# EasyEDA Pro project ADA4530_2025-03-15.epro, board PCB7
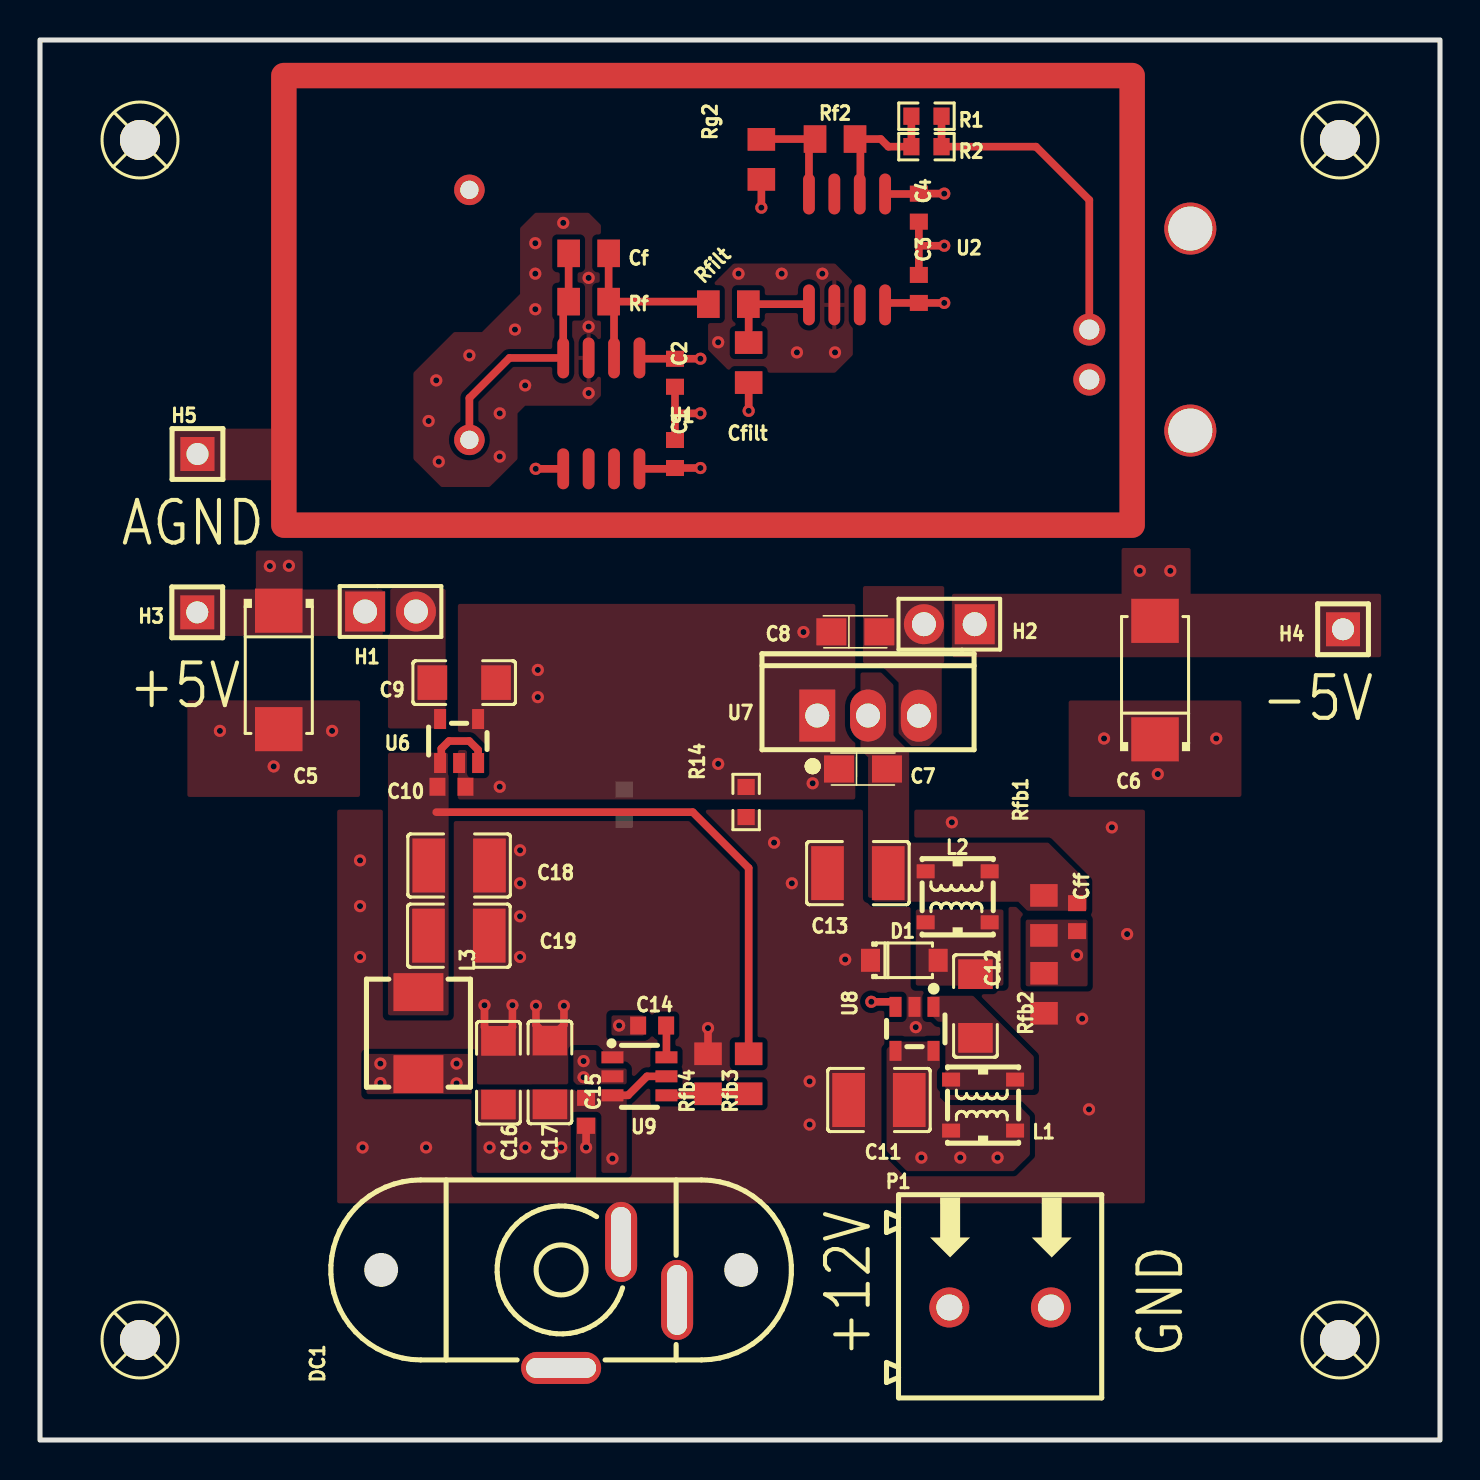
[diagram p12: board, top side]
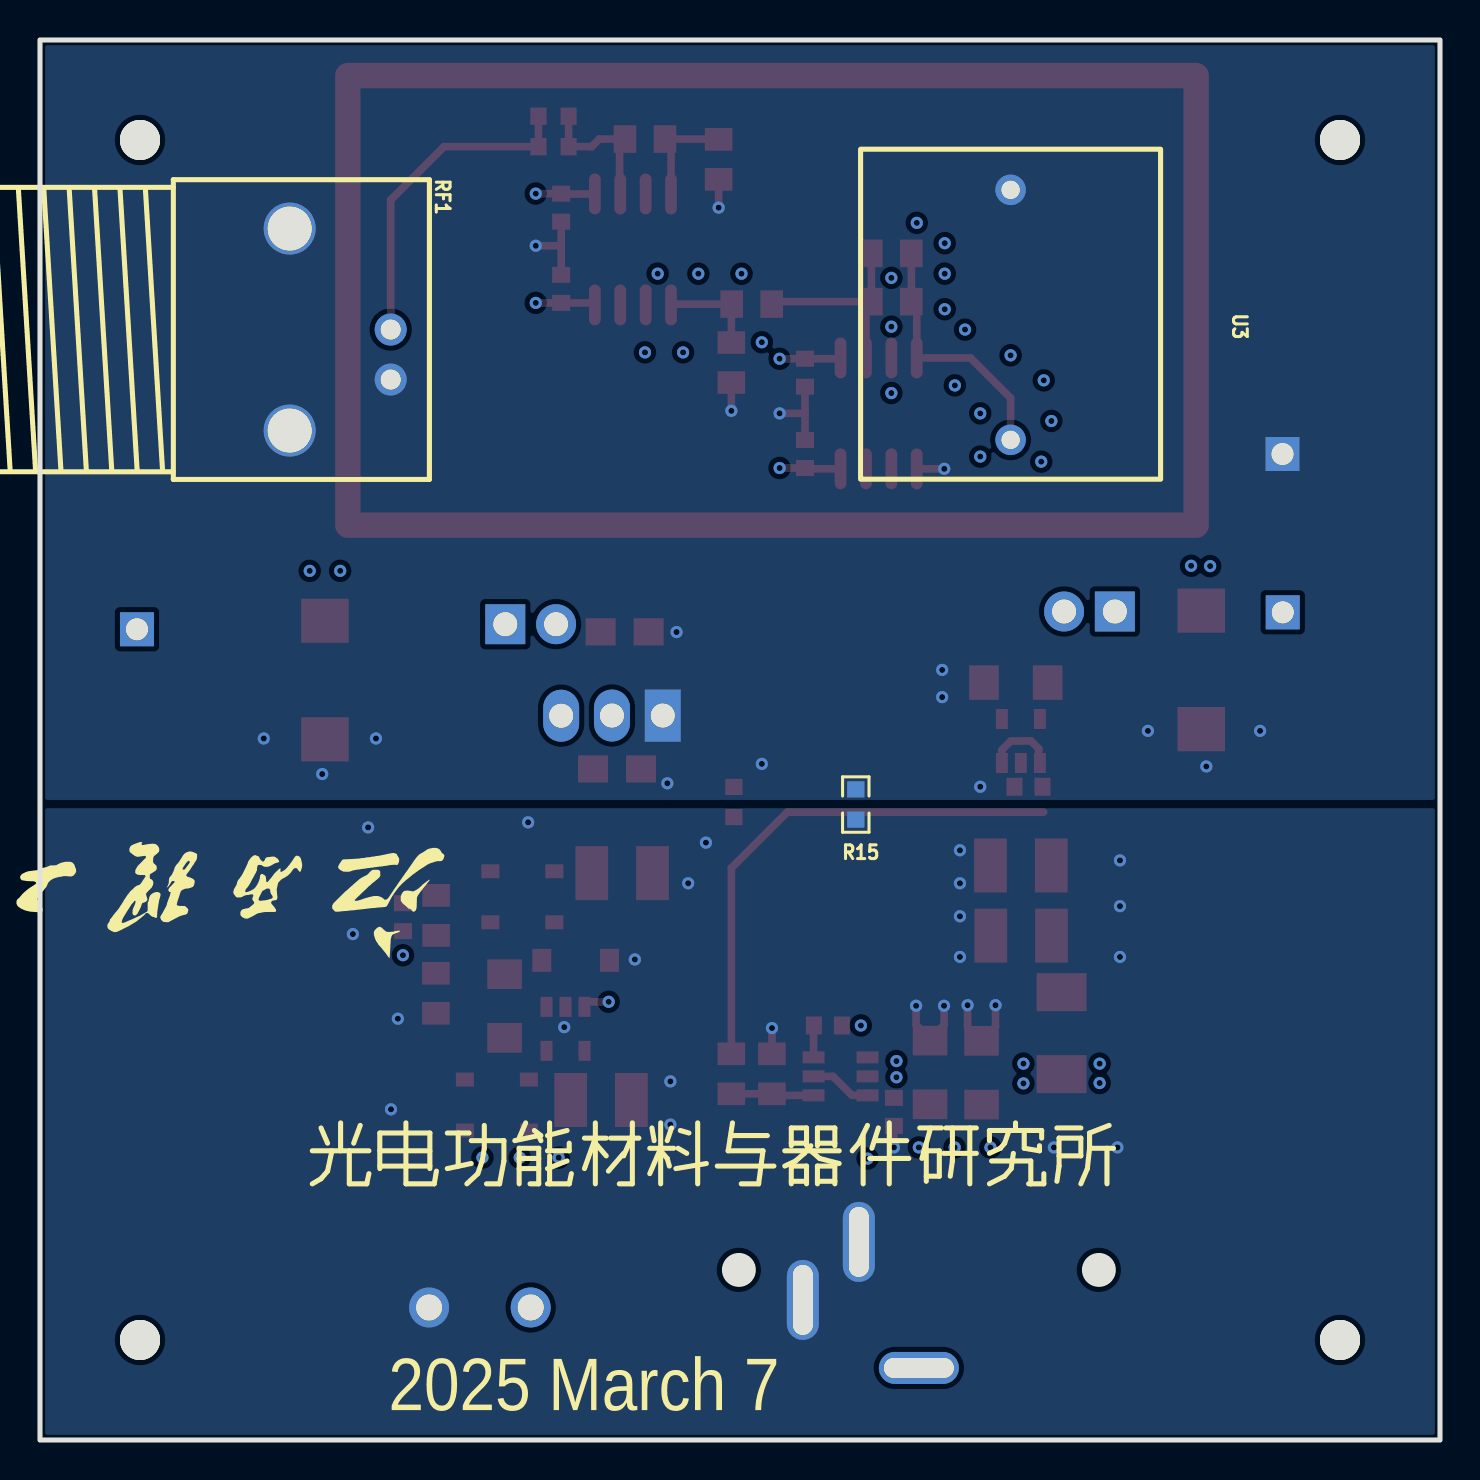
[diagram p13: board, bottom side, seen from below]

Outline 70 x 70 mm; copper layers: Top Layer, Inner1, Inner2, Bottom Layer. Coordinates in mm from the lower left corner of the outline.
Outline path: rectangle 0,70 70,0
Stack: Top Layer 0.035mm 外层铜厚1oz / Dielectric1 0.2104mm 7628 RC49% 8.6mil / Inner1 0.0152mm 内层铜厚 / Dielectric2 1.065mm 1.1mm H/HOZ Copper / Inner2 0.0152mm 内层铜厚 / Dielectric3 0.2104mm 7628 RC49% 8.6mil / Bottom Layer 0.035mm 外层铜厚1oz

## Design rules (mm)
template: 自定义配置
spacing copperThickness1oz (default): track to track 0.102, other pairs 0.152 to 0.3
spacing copperThickness2oz: track to track 0.203, other pairs 0.152 to 0.3
track width copperThickness1oz (default): min 0.127, default 0.254, max 2.54
track width copperThickness2oz: min 0.203, default 0.254, max 2.54
differential pair differentialPair (default): width min 0.127, default 0.254, max 2.54; gap min 0.152, default 0.152
via viaSize (default): diameter min 0.5, default 0.61, max 10; hole min 0.3, default 0.305, max 6.299
net -5V uses 全连接
net AGND uses 全连接
net +5V uses 全连接
net -6V uses 全连接
net -5VOUT uses 全连接
net +5VOUT uses 全连接
net +6.5V uses 全连接
net +12V uses 全连接
net GND uses 全连接
net $1N3853 uses 全连接
net $1N3691 uses 全连接
net $1N5017 uses 全连接
net $1N3697 uses 全连接

## Placement (name value [footprint] x y rotation side)
C1  100nF  [C0603]  31.75 49.3 270 top
C2  100nF  [C0603]  31.75 53.36 90 top
C3  100nF  [C0603]  43.94 57.55 90 top
C4  100nF  [C0603]  43.94 61.62 90 top
C5  10uF  [CAP-SMD_L6.0-W3.2-R-RD]  11.94 38.5 90 top
C6  10uF  [CAP-SMD_L6.0-W3.2-R-RD]  55.75 38 270 top
C7  2.2uF  [CASE-A_3216]  41.15 33.55 0 top
C8  1uF  [CASE-A_3216]  40.77 40.41 0 top
C9  10uF  [C1206]  21.21 37.87 180 top
C10  1uF  [C0603]  20.57 32.66 180 top
C11  22uF  [C1210]  41.95 17 0 top
C12  2.2uF  [C1206]  46.77 21.7 90 top
C13  22uF  [C1210]  40.89 28.34 0 top
C14  100nF  [C0603]  30.61 20.72 180 top
C15  100nF  [C0603]  27.31 16.41 90 top
C16  10uF  [C1206]  22.92 18.36 90 top
C17  10uF  [C1206]  25.5 18.38 90 top
C18  22uF  [C1210]  20.96 28.72 180 top
C19  22uF  [C1210]  20.94 25.22 180 top
Cf  180pF  [R0805]  27.43 59.33 180 top
Cff  1nF  [C0603]  51.85 26.14 90 top
Cfilt  1.5nF  [R0805]  35.43 53.87 90 top
D1  MBR0520LT1G  [SOD-123_L2.8-W1.8-LS3.7-RD]  43.22 23.98 0 top
DC1  DC-018-2.5A-2.5  [DC-IN-TH_DC-018]  28.96 6.75 90 top
H1  PZ254V-11-02P  [HDR-TH_2P-P2.54-V-M]  17.53 41.42 0 top
H2  PZ254V-11-02P  [HDR-TH_2P-P2.54-V-M]  45.47 40.79 180 top
H3  PZ254V-11-01P  [HDR-TH_1P-P2.54-V-M]  7.86 41.38 0 top
H4  PZ254V-11-01P  [HDR-TH_1P-P2.54-V-M]  65.15 40.54 0 top
H5  PZ254V-11-01P  [HDR-TH_1P-P2.54-V-M]  7.87 49.3 0 top
L1  22uH  [IND-SMD_4P-L3.8-W3.5_BL]  47.15 16.75 90 top
L2  22uH  [IND-SMD_4P-L3.8-W3.5_BL]  45.88 27.16 90 top
L3  4.7uH  [IND-SMD_L5.4-W5.2_FXL0530]  18.92 20.34 270 top
P1  WJ500V-5.08-2P  [CONN-TH_2P-P5.00_WJ500V-5.08-2P]  48.01 6.63 0 top
R1  499Ω  [R0603]  44.32 66.19 0 top
R2  0Ω  [R0603]  44.32 64.67 180 top
R14  0Ω  [R0603]  35.31 31.9 270 top
R15  0Ω  [R0603]  29.21 31.77 270 bottom
Rf  15.8kΩ  [R0805]  27.43 56.92 180 top
RF1  KH-BNC50-3511  [ANT-TH_KH-BNC50-3511]  54.99 55.52 270 bottom
Rf2  3.4kΩ  [R0805]  39.75 65.05 180 top
Rfb1  39.2kΩ  [R0805]  50.2 26.23 90 top
Rfb2  10kΩ  [R0805]  50.2 22.33 90 top
Rfb3  75kΩ  [R0805]  35.43 18.31 90 top
Rfb4  10kΩ  [R0805]  33.4 18.31 270 top
Rfilt  1.33kΩ  [R0805]  34.42 56.79 180 top
Rg2  182Ω  [R0805]  36.07 64.03 270 top
SCREW1  -  [M2螺丝]  5 65 0 top
SCREW2  -  [M2螺丝]  5 5 0 top
SCREW3  -  [M2螺丝]  65 5 0 top
SCREW4  -  [M2螺丝]  65 65 0 top
U1  ADA4530-1ARZ  [SOIC-8_L4.9-W3.9-P1.27-LS6.0-BL]  28.07 51.33 0 top
U2  ADA4530-1ARZ  [SOIC-8_L4.9-W3.9-P1.27-LS6.0-BL]  40.35 59.53 0 top
U3  -  [S1227-1010BR]  13.97 64.54 270 bottom
U6  TPS78450QDBVRQ1  [SOT-23-5_L2.9-W1.6-P0.95-LS2.8-BL]  20.96 34.95 0 top
U7  LM7905CT/NOPB  [TO-220-3_L10.0-W4.5-P2.54-L]  41.4 36.22 0 top
U8  LM2611AMFX/NOPB  [SOT-23-5_L2.9-W1.6-P0.95-LS2.8-BR]  43.72 20.56 90 top
U9  TPS562201DDCR  [SOT-23-6_L2.9-W1.6-P0.95-LS2.8-BR]  29.97 18.18 180 top

## Footprints (pads in the part's own frame, mm; a bottom-side part is the same pattern mirrored in y, then rotated)
ANT-TH_KH-BNC50-3511
  round 1.6 hole 1: 1(0,2.525) 2(2.5,2.525)
  round 2.601 hole 2.2: 3(5.05,-2.525) 4(-5.05,-2.525)
C0603
  rect 0.8x0.9 smd: 1(-0.7,0) 2(0.7,0)
C1206
  rect 1.485x1.728 smd: 1(-1.593,0) 2(1.593,0)
C1210
  rect 1.635x2.7 smd: 1(-1.518,0) 2(1.518,0)
CAP-SMD_L6.0-W3.2-R-RD
  rect 2.208x2.376 smd: 1(2.961,0) 2(-2.961,0)
CASE-A_3216
  rect 1.5x1.359 smd: 1(-1.2,0) 2(1.2,0)
CONN-TH_2P-P5.00_WJ500V-5.08-2P
  round 2 hole 1.3: 1(-2.54,0) 2(2.54,0)
DC-IN-TH_DC-018
  oval 1.6x4 hole 1x3.5: 1(-3.15,2.9)
  oval 4x1.6 hole 3.5x1: 2(0.25,-2.9) 3(3.15,-0.1)
HDR-TH_1P-P2.54-V-M
  rect 1.7x1.7 hole 1.1: 1(0,0)
HDR-TH_2P-P2.54-V-M
  rect 2x2 hole 1.2: 1(-1.27,0)
  round 2 hole 1.2: 2(1.27,0)
IND-SMD_4P-L3.8-W3.5_BL
  rect 0.7x0.9 smd: 1(-1.275,-1.6) 2(1.275,-1.6) 3(1.275,1.6) 4(-1.275,1.6)
IND-SMD_L5.4-W5.2_FXL0530
  rect 1.9x2.5 smd: 1(-2.05,0) 2(2.05,0)
M2螺丝
  round 2 hole 2: 1(0,0)
R0603
  rect 0.806x0.864 smd: 1(-0.753,0) 2(0.753,0)
R0805
  rect 1.133x1.377 smd: 1(-1,0) 2(1,0)
S1227-1010BR
  round 1.524 hole 0.914: 1(2.032,-7.5) 2(14.532,-7.5)
SOD-123_L2.8-W1.8-LS3.7-RD
  rect 0.95x1.15 smd: 1(-1.692,0) 2(1.692,0)
SOIC-8_L4.9-W3.9-P1.27-LS6.0-BL
  oval 0.588x2.045 smd: 1(-1.905,-2.772) 2(-0.635,-2.772) 3(0.635,-2.772) 4(1.905,-2.772) 5(1.905,2.772) 6(0.635,2.772) 7(-0.635,2.772) 8(-1.905,2.772)
SOT-23-5_L2.9-W1.6-P0.95-LS2.8-BL
  rect 0.6x1 smd: 1(-0.95,-1.1) 2(0,-1.1) 3(0.95,-1.1) 4(0.95,1.1) 5(-0.95,1.1)
SOT-23-5_L2.9-W1.6-P0.95-LS2.8-BR
  rect 1x0.6 smd: 1(1.1,-0.95) 2(1.1,0) 3(1.1,0.95) 4(-1.1,0.95) 5(-1.1,-0.95)
SOT-23-6_L2.9-W1.6-P0.95-LS2.8-BR
  rect 1.1x0.6 smd: 1(1.35,-0.95) 2(1.35,0) 3(1.35,0.95) 4(-1.35,0.95) 5(-1.35,0) 6(-1.35,-0.95)
TO-220-3_L10.0-W4.5-P2.54-L
  rect 1.8x2.6 hole 1.2: 1(-2.54,0.005)
  oval 1.8x2.6 hole 1.2: 2(0,0.005) 3(2.54,-0.005)

## Nets
As in the schematic.

Pads without a net: SCREW1 1; SCREW2 1; SCREW3 1; SCREW4 1; U1 2 3; U2 3 7

## Via types
v1: diameter 0.61, hole 0.305, Top Layer to Bottom Layer, 88 vias

## Routing (per net, layer and track width the routed paths; a pad name or vN(x,y) marks a point on that pad's centre or on a via; arc(x,y) is an arc through that point)
+5V: length 6
  Top Layer w0.381: U2.5 43.92,62.3 C4.2 v1(45.21,62.32) ; U1.5 30.01,54.06 C2.2 v1(33.02,54.06)
  vias: v1(11.49,43.69) v1(12.45,43.71)
+6.5V: length 29.6
  Top Layer w0.381: 19.81,31.39 32.64,31.39 35.43,28.6 Rfb3.2 ; 20,33.85 20.07,33.91 20.07,34.57 20.45,34.95 21.46,34.95 21.91,34.51 U6.3
+12V: length 3.1
  Top Layer w0.381: U9.5 30.35,18.18 29.4,17.23 U9.3
  vias: v1(22.48,14.63) v1(24.27,14.63) v1(26.06,14.63) v1(28.62,14.07) v1(44.07,14.12) v1(46.01,14.12) v1(47.88,14.12)
-5V: length 6.1
  Top Layer w0.381: U2.4 42.36,56.85 C3.1 v1(45.21,56.85) ; U1.4 31.71,48.56 C1.2 v1(33.02,48.6)
  vias: v1(54.99,43.46) v1(56.51,43.46)
AGND: length 12.2
  Top Layer w0.381: Rg2.2 v1(36.07,61.62) ; 31.75,51.28 C1.1 ; 31.75,51.28 31.81,51.33 v1(33.02,51.33) ; 31.75,51.28 C2.1 ; 43.94,59.64 44.01,59.71 v1(45.21,59.71) ; 43.94,59.64 C4.1 ; 43.94,59.64 C3.2 ; U1.1 v1(24.79,48.56) 24.76,48.54 ; Cfilt.1 v1(35.43,51.46)
  vias: v1(9,35.46) v1(11.68,33.68) v1(14.61,35.46) v1(22.99,32.66) v1(24.89,38.5) v1(24.89,37.14) v1(33.91,33.81) v1(38.17,40.4) v1(38.63,32.84) v1(53.2,35.08) v1(55.89,33.3) v1(58.81,35.08)
GND: length 10.4
  Top Layer w0.381: v1(24.8,21.71) 24.8,20.75 25.5,20.06 26.2,20.76 v1(26.2,21.71) ; v1(22.22,21.74) 22.22,20.65 C16.2 23.62,20.66 v1(23.62,21.74) ; C15.1 v1(27.31,14.63) ; Rfb4.1 v1(33.4,20.6)
  vias: v1(16,28.98) v1(16,26.69) v1(16,24.15) v1(16.13,14.63) v1(19.3,14.63) v1(24,29.49) v1(24,27.84) v1(24,26.19) v1(24,24.15) v1(36.7,29.87) v1(37.59,27.84) v1(38.48,17.93) v1(38.48,15.77) v1(40.26,24.03) v1(43.79,20.64) v1(45.59,30.88) v1(52.11,21.06) v1(52.45,16.53) v1(53.59,30.63) v1(54.36,25.3)
GRD1:
  vias: v1(19.43,50.95) v1(19.81,52.98) v1(19.94,48.92) v1(21.47,54.23) v1(22.99,51.33) v1(22.99,49.17) v1(23.75,55.52) v1(24.26,52.73) v1(24.76,59.84) v1(24.76,58.32) v1(24.76,56.54) v1(26.16,60.86) v1(27.43,58.11) v1(27.43,55.67) v1(27.43,52.35)
GRD2:
  vias: v1(33.91,54.89) v1(34.93,58.32) v1(37.08,58.32) v1(37.85,54.38) v1(39.12,58.32) v1(39.75,54.38)
IN-: length 13
  Top Layer w0.381: U3.2 21.47,52.1 23.47,54.1 U1.8 26.16,56.65 Rf.2 Cf.2
$1N1239: length 10.4
  Top Layer w0.381: Rf.1 28.7,56.65 U1.6 ; Rf.1 Cf.1 ; Rf.1 33.29,56.92 Rfilt.2
$1N1441: length 4.4
  Top Layer w0.381: 35.43,55.46 35.43,56.78 35.42,56.79 38.41,56.79 U2.1
$1N1504: length 7.4
  Top Layer w0.381: R1.1 R2.2 42.42,64.67 42.04,65.05 Rf2.1 41.02,64.78 41.02,62.33 U2.6
$1N1510: length 5.6
  Top Layer w0.381: Rg2.1 36.08,65.05 Rf2.2 38.45,64.74 U2.8
$1N1693: length 16.5
  Top Layer w0.381: RF1.1 52.47,62 49.8,64.67 R2.1 R1.2
$1N3697: length 1
  Top Layer w0.381: 42.52,21.91 v1(41.57,21.91)
  vias: v1(51.85,24.24)
$1N5017:
  vias: v1(17.02,18.82) v1(17.02,17.85) v1(20.83,18.82) v1(20.83,17.83) v1(27.18,18.95) v1(27.18,18.14) v1(28.96,20.72)
$1N5032: length 1.6
  Top Layer w0.381: U9.6 31.32,20.71 C14.1
$1N5055: length 4.1
  Top Layer w0.381: U9.4 33.32,17.23 Rfb4.2 Rfb3.1

## Copper pours and planes (outline as drawn; the poured copper is in the pictures)
+5V on Top Layer: 6.67,42.53 17.27,42.53 17.27,40.2 6.67,40.2
+5V on Top Layer: 10.8,44.47 13.14,44.47 13.14,40.35 10.8,40.35
+5V on Inner2: 23.37,42.69 41.53,60.86 46.86,60.86 48.01,62 48.01,66.95 45.97,68.98 12.83,68.98 1.14,57.3 1.14,45.23 3.68,42.69
+5VOUT on Top Layer: 17.4,42.57 20.28,42.57 20.28,35.58 17.4,35.58
+6.5V on Top Layer: 17.4,34.37 20.43,34.37 20.43,21.23 17.4,21.23
+12V on Top Layer: 21.83,17.52 29.34,17.52 29.34,13.36 21.83,13.36
+12V on Top Layer: 45,19.92 45,17.13 45.38,16.75 48.92,16.75 49.49,16.17 49.49,14.26 48.68,13.44 43.34,13.44 42.33,14.46 42.33,19.54 42.71,19.92
+12V on Inner2: 21.62,15.81 48.64,15.81 48.64,2.44 21.62,2.44
-5V on Top Layer: 54.08,44.6 57.53,44.6 57.53,39.32 54.08,39.32
-5V on Top Layer: 45.59,42.31 67.06,42.31 67.06,39.14 45.59,39.14
-5V on Inner2: 64.01,42.69 66.93,45.62 66.93,59.33 57.28,68.98 51.18,68.98 49.15,66.95 49.15,60.86 47.12,58.82 41.02,58.82 24.89,42.69
-5VOUT on Top Layer: 41.15,42.69 45.21,42.69 45.21,38.83 41.15,38.83
-5VOUT on Top Layer: 41.15,39.65 42.93,37.87 42.93,35.33 43.56,34.69 44.45,34.69 45.09,35.33 45.09,39.52 44.83,39.77 41.28,39.77
-6V on Top Layer: 40.26,35.28 40.26,38 40.64,38.38 42.16,38.38 42.67,37.87 42.67,35.24 43.46,34.46 43.46,33.91 41.63,33.91
-6V on Top Layer: 41.4,34.17 43.46,34.17 43.46,27.11 41.4,27.11
-6V on Top Layer: 41.67,26.91 48.91,26.91 49.36,26.46 52.36,26.46 52.36,27.93 50.42,29.87 41.67,29.87
AGND on Top Layer: 20.89,41.81 40.77,41.81 40.77,32.03 20.89,32.03
AGND on Top Layer: 7.37,36.98 16,36.98 16,32.15 7.37,32.15
AGND on Top Layer: 51.44,36.98 60.07,36.98 60.07,32.15 51.44,32.15
AGND on Top Layer: 6.6,50.57 12.19,50.57 12.19,47.99 6.6,47.99
AGND on Bottom Layer: 0,70 70,70 70,32 0,32
AGND on Inner1: 0.15,70 70,70 70,29.89 0.15,29.89
GND on Top Layer: 26.8,16.15 27.81,16.15 27.81,12.6 26.8,12.6
GND on Top Layer: 14.86,31.52 55.25,31.52 55.25,11.83 14.86,11.83
GND on Bottom Layer: 0,31.59 70,31.59 70,0 0,0
GND on Inner1: 0,29.93 70,29.93 70,0.38 0,0.38
GRD1 on Top Layer: 20.07,47.65 18.67,49.05 18.67,53.36 20.7,55.39 22.1,55.39 24,57.3 24,60.6 24.76,61.36 27.43,61.36 28.05,60.75 28.05,52.2 27.56,51.71 24.26,51.71 23.88,51.33 23.88,49.05 22.48,47.65
GRD1 on Inner1: 20.08,47.65 18.68,49.05 18.68,53.36 20.71,55.39 22.11,55.39 24.01,57.3 24.01,60.6 24.77,61.36 27.44,61.36 28.06,60.75 28.06,52.2 27.57,51.71 24.27,51.71 23.89,51.33 23.89,49.05 22.49,47.65
GRD2 on Top Layer: 33.4,57.55 34.67,58.82 39.75,58.82 40.64,57.94 40.64,54.25 39.75,53.36 34.55,53.36 33.4,54.51
GRD2 on Inner1: 33.46,57.62 34.73,58.89 39.81,58.89 40.7,58 40.7,54.32 39.81,53.43 34.61,53.43 33.46,54.57
$1N3691 on Top Layer: 46.66,22.21 49.69,19.17 49.69,17.51 45.27,17.51 45.27,20.91 44.89,20.91 44.49,21.32 44.49,22.21
$1N3697 on Top Layer: 52.38,26.02 52.38,22.68 49.28,22.68 49.28,26.02
$1N3697 on Inner2: 40.51,24.92 52.32,24.92 52.32,20.6 40.51,20.6
$1N3853 on Top Layer: 48.17,26.53 48.17,22.72 43.79,22.72 43.79,26.53
$1N5017 on Top Layer: 26.67,19.49 27.77,19.49 27.94,19.32 27.94,18.67 29.24,18.67 29.34,18.56 29.34,17.8 29.21,17.68 26.92,17.68 26.67,17.93
$1N5017 on Top Layer: 28.57,21.23 30.23,21.23 30.23,20.22 28.57,20.22
$1N5017 on Top Layer: 16.32,19.3 21.59,19.3 21.59,17.3 16.32,17.3
$1N5017 on Inner2: 14.93,22.88 31.37,22.88 31.37,16.41 14.93,16.41

## Text on the board
Bottom Silkscreen Layer: 2025 March 7 | 光电功能材料与器件研究所
Top Silkscreen Layer: AGND | +5V | -5V | +12V | GND
